# EAGLE design ornamentOrbV1 (EAGLE 9.1.0)
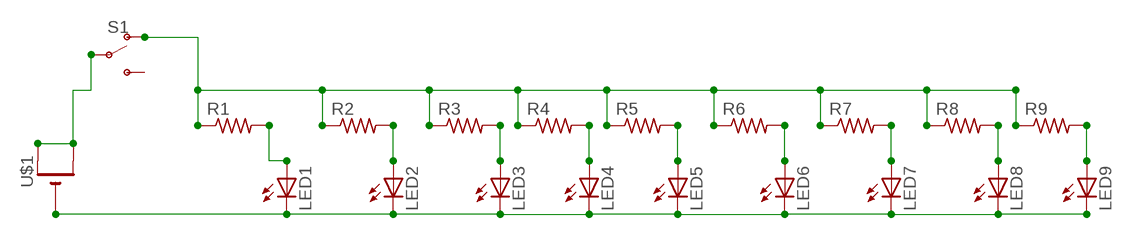
[diagram p0: schematic, sheet 1]

## Parts
LED1  LED5MM  [LED5MM]
LED2  LED5MM  [LED5MM]
LED3  LED5MM  [LED5MM]
LED4  LED5MM  [LED5MM]
LED5  LED5MM  [LED5MM]
LED6  LED5MM  [LED5MM]
LED7  LED5MM  [LED5MM]
LED8  LED5MM  [LED5MM]
LED9  LED5MM  [LED5MM]
R1  R-US_R0805  [R0805]
R2  R-US_R0805  [R0805]
R3  R-US_R0805  [R0805]
R4  R-US_R0805  [R0805]
R5  R-US_R0805  [R0805]
R6  R-US_R0805  [R0805]
R7  R-US_R0805  [R0805]
R8  R-US_R0805  [R0805]
R9  R-US_R0805  [R0805]
S1  SWITCH-SPDT-SMD-RIGHT-ANGLE  [SWITCH_SPST_SMD_A]
U$1  CR2032SMT  [CR2032-SMD]

## Nets
N$1: LED1.A R1.2
N$2: LED2.A R2.2
N$3: LED3.A R3.2
N$4: LED4.A R4.2
N$5: LED5.A R5.2
N$6: LED6.A R6.2
N$7: LED7.A R7.2
N$8: LED8.A R8.2
N$9: LED9.A R9.2
N$10: LED1.K(C) LED2.K(C) LED3.K(C) LED4.K(C) LED5.K(C) LED6.K(C) LED7.K(C) LED8.K(C) LED9.K(C) U$1.-
N$11: R1.1 R2.1 R3.1 R4.1 R5.1 R6.1 R7.1 R8.1 R9.1 S1.1(O)
N$12: S1.2(P) U$1.+$1(+) U$1.+$2(+1)
Unconnected: S1.3(S)

## Library data of the parts
LED1-LED9 = adafruit:LED: LED OSRAM: - CHIPLED LG R971, LG N971, LY N971, LG Q971, LY Q971, LO R971, LY R971 LH N974, LH R974 LS Q976, LO Q976, LY Q976 LO Q996 - Hyper CHIPLED LW Q18S LB Q993, LB Q99A, LB R99A - SideLED LS A670, LO A670, LY A670, LG A670, LP A670 LB A673, LV A673, LT A673, LW A673 LH A674 LY A675 LS A676, LA A676, LO A676, LY A676, LW A676 LS A679, LY A679, LG A679 - Hyper Micro SIDELED® LS Y876, LA Y876, LO Y876, LY Y876 LT Y87S - SmartLED LW L88C, LW L88S LB L89C, LB L89S, LG L890 LS L89K, LO L89K, LY L89K LS L896, LA L896, LO L896, LY L896 - TOPLED LS T670, LO T670, LY T670, LG T670, LP T670 LSG T670, LSP T670, LSY T670, LOP T670, LYG T670 LG T671, LOG T671, LSG T671 LB T673, LV T673, LT T673, LW T673 LH T674 LS T676, LA T676, LO T676, LY T676, LB T676, LH T676, LSB T676, LW T676 LB T67C, LV T67C, LT T67C, LS T67K, LO T67K, LY T67K, LW E67C LS E67B, LA E67B, LO E67B, LY E67B, LB E67C, LV E67C, LT E67C LW T67C LS T679, LY T679, LG T679 LS T770, LO T770, LY T770, LG T770, LP T770 LB T773, LV T773, LT T773, LW T773 LH T774 LS E675, LA E675, LY E675, LS T675 LS T776, LA T776, LO T776, LY T776, LB T776 LHGB T686 LT T68C, LB T68C - Hyper Mini TOPLED® LB M676 - Mini TOPLED Santana® LG M470 LS M47K, LO M47K, LY M47K Source: http://www.osram.convergy.de/
R1-R9 = adafruit:R-US_: RESISTOR, American symbol
S1 = SparkFun-Switches:SWITCH-SPDT: Single Pole, Double Throw (SPDT) Switch Single-pole, double-throw (SPDT) switch. Variant Overview SMD-AYZ0202 Surface Mount DPDT Switch <https://www.sparkfun.com/products/597> (COM-00597) Used on e.g. LilyPad Arduino USB - ATmega32U4 Board <https://www.sparkfun.com/products/12049> PTH-11.6X4.0MM SPDT Mini Power Switch <https://www.sparkfun.com/products/102> (COM-00102) Used on e.g. SparkFun Simon Says - Through-Hole Soldering Kit <https://www.sparkfun.com/products/10547> (KIT-10547) PTH-11.6X4.0MM-KIT KIT version of SPDT Mini Power Switch - Simplifies soldering by removing tStop of switch pins - only one side can be soldered. PTH-11.6X4.0MM-LOCK LOCK version of SPDT Mini Power Switch - Offset pins hold switch in place for easier soldering. SMD-RIGHT-ANGLE Surface Mount Right Angle Switch <https://www.sparkfun.com/products/10860> (COM-10860) Used on e.g. SparkFun ESP8266 Thing <https://www.sparkfun.com/products/13231>; PROD_ID: SWCH-10651; SF_SKU: COM-10860
U$1 = adafruit:CR2032

## Net classes
0 default: clearance 0.205 mm

## Board
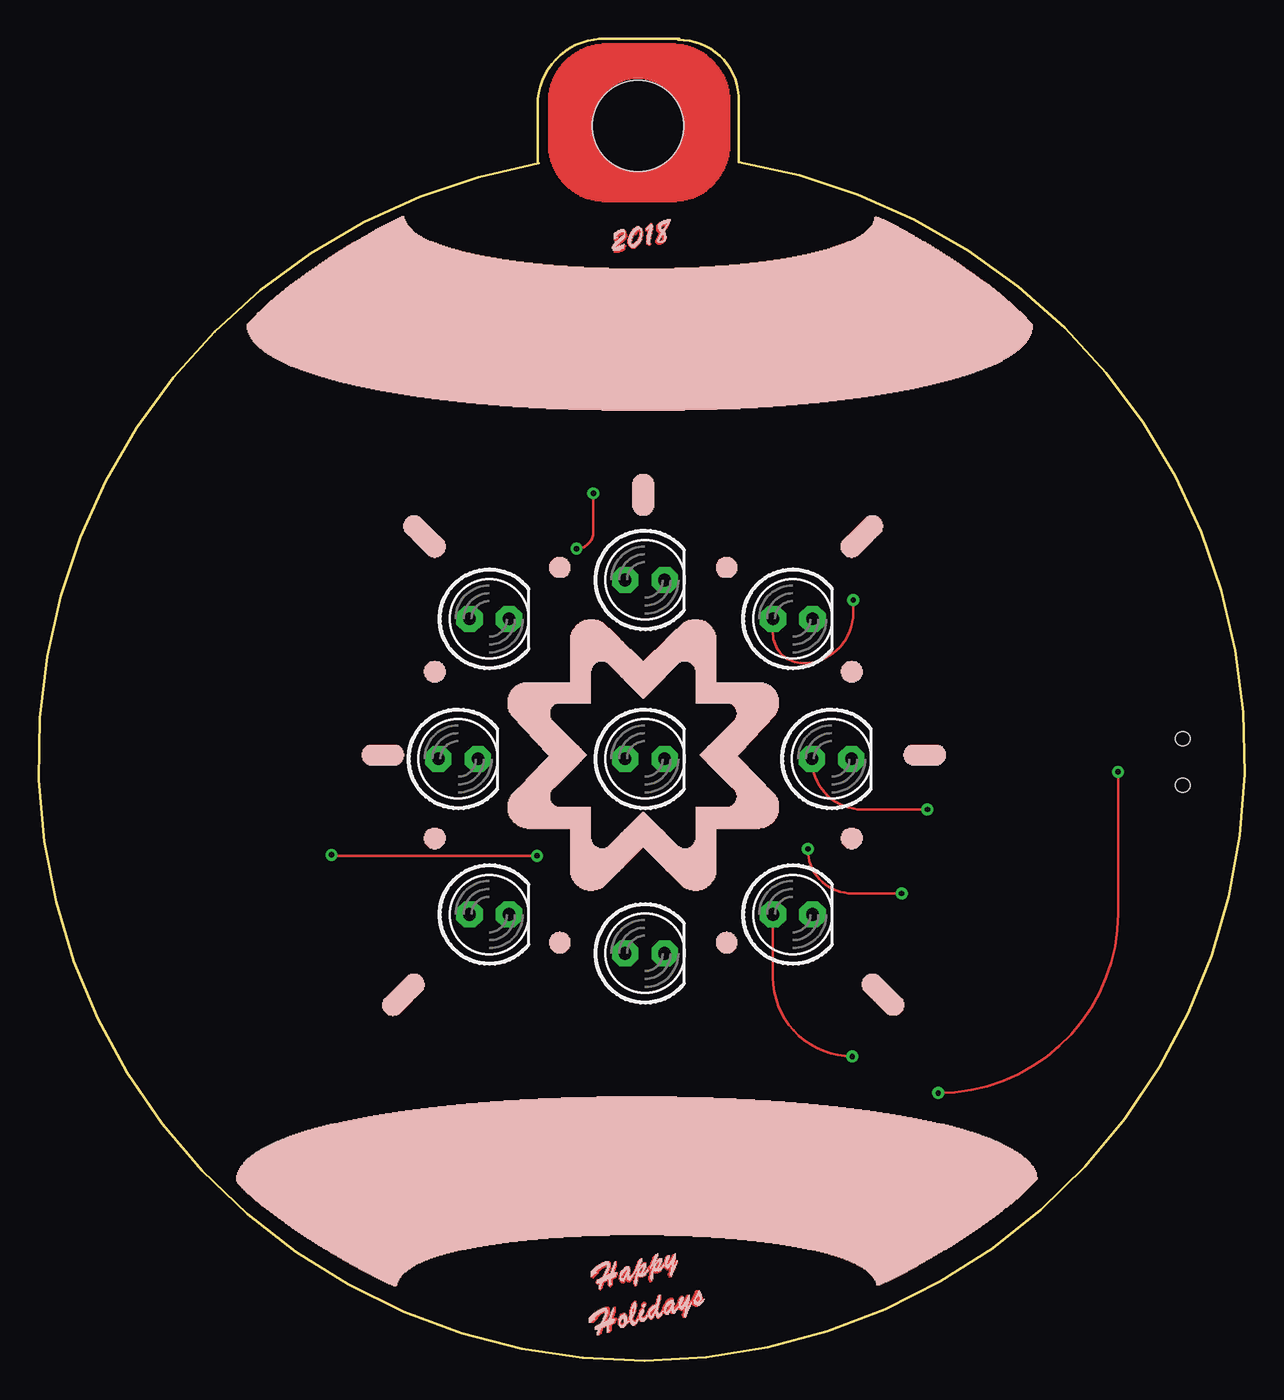
[diagram p1: board, top side]
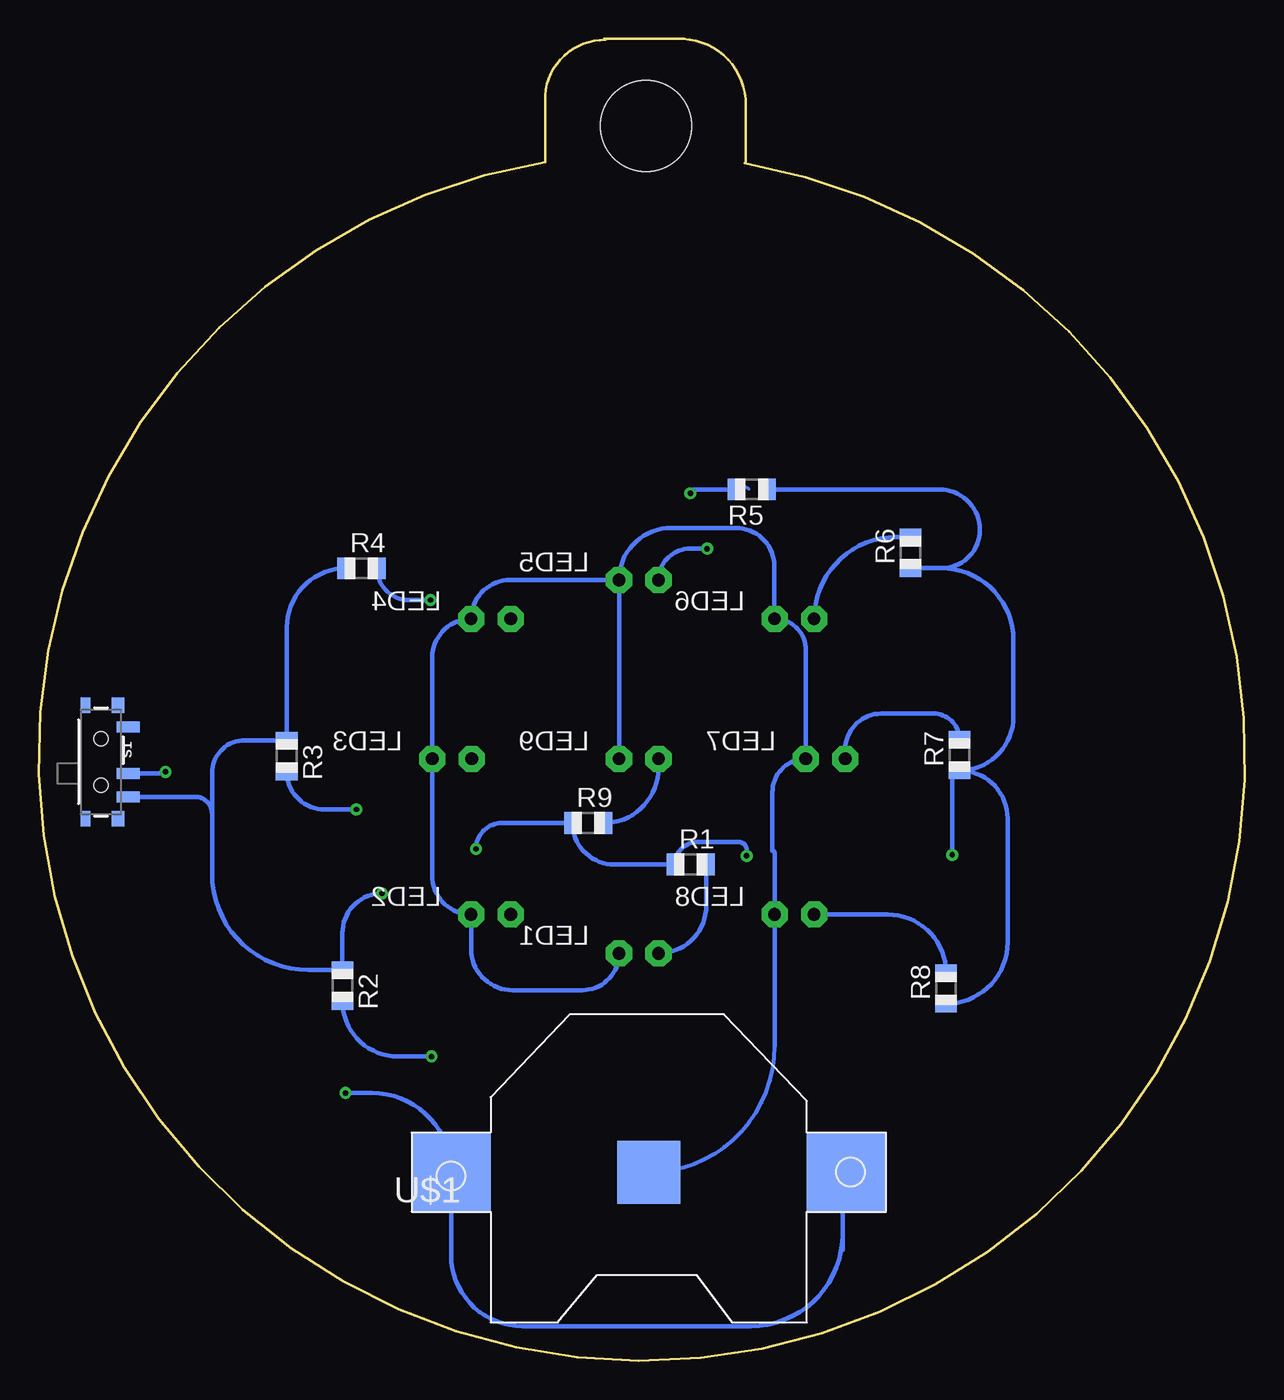
[diagram p2: board, bottom side, seen from below]

Size 77.48 x 84.96 mm. Coordinates in mm from the lower left corner, seen from the top.
Outline: 32.13,76.96 arc341 44.96,77.02 44.96,80.89
Outline: 44.96,80.96 arc93 41.09,84.89
Outline: 32.07,76.96 32.07,81.08 arc-82 36.07,84.96
Outline: 36.01,84.96 41.15,84.96
Copper layers (1*16): Top 0.035mm / dielectric 1.5mm / Bottom 0.035mm
Design rules "default": minimum track width 6mil, minimum drill 0.35mm, track to track 6mil, track to pad 6mil, pad to pad 6mil, via to via 6mil, smd to smd 6mil, copper to edge 40mil, drill to drill 6mil, minimum pad ring 10mil, minimum via ring 8mil, stop-mask expansion 4mil, vias tented up to drill 0mil, thermal gap 10mil
Holes 5.84 mm at 38.48,79.37

### Footprints (pad centres in the part's own frame; a part is rotated, then mirrored left to right if it is on the bottom)
LED5MM = drill 0.813 pad 1.676 octagon: A -1.27,0; K 1.27,0
R0805 = smd 1.1 x 1.4: 1 -1,0; 2 1,0
SWITCH_SPST_SMD_A = smd 0.7 x 1.5: 1 -2.25,-1.75; 2 -0.75,-1.75; 3 2.25,-1.75 | smd 1 x 0.6: GND1 -3.65,1; GND3 3.65,1 | smd 1 x 0.8: GND2 -3.65,-1.1; GND4 3.65,-1.1 | hole 0.9: -1.5,0; 1.5,0
CR2032-SMD = smd 5.08 x 5.08: +$1 -12.7,0; +$2 12.7,0 | smd 4.064 x 4.064: - 0,0

### Placement (x,y rotation side)
LED1  38.94,26.18 0 top
LED2  48.44,28.68 0 top
LED3  50.94,38.68 0 top
LED4  48.44,47.68 0 top
LED5  38.94,50.18 0 top
LED6  28.94,47.68 0 top
LED7  26.94,38.68 0 top
LED8  28.94,28.68 0 top
LED9  38.94,38.68 0 top
R1  35.6,31.89 0 bottom
R2  57.98,24.11 270 bottom
R3  61.55,38.85 270 bottom
R4  56.75,50.93 0 bottom
R5  31.68,56 180 bottom
R6  21.47,51.93 90 bottom
R7  18.33,38.93 90 bottom
R8  19.2,23.93 90 bottom
R9  42.19,34.56 0 bottom
S1  73.5,38.48 90 bottom
U$1  38.29,12.11 180 bottom

### Tracks (layer width: path | path; a pad name or v marks a point on that pad's centre or on a via)
N$1
  Bottom 0.305: LED1.A arc-90 34.6,29.24 R1.2
N$2  (via drill 0.35)
  Top 0.152: v52.26,19.55 arc-90 47.17,24.65 LED2.A
  Bottom 0.305: v52.26,19.55 54.42,19.55 arc90 R2.2
N$3  (via drill 0.35)
  Top 0.152: v57.09,35.43 52.92,35.43 arc-90 LED3.A
  Bottom 0.305: v57.09,35.43 59.12,35.43 arc90 R3.2
N$4  (via drill 0.35)
  Top 0.152: v52.33,48.89 52.33,48.06 arc-90 49.09,44.82 arc-90 47.17,46.74 LED4.A
  Bottom 0.305: v52.33,48.89 53.71,48.89 arc90 R4.2
N$5  (via drill 0.35)
  Top 0.152: v34.55,52.19 arc90 35.63,53.27 v35.63,55.75
  Bottom 0.2: 31.84,56 arc-90 R5.2
  Bottom 0.305: LED5.A arc90 35.65,52.19 v34.55,52.19 | v35.63,55.75 arc90 35.37,56 R5.2
N$6
  Bottom 0.305: LED6.A arc90 22.41,52.93 R6.2
N$7
  Bottom 0.305: LED7.A 25.67,39.29 arc90 23.37,41.59 19.99,41.59 arc90 R7.2
N$8
  Bottom 0.305: LED8.A 22.94,28.68 arc90 R8.2
N$9
  Bottom 0.254: LED9.A 37.67,38.08
  Bottom 0.305: 37.67,38.08 arc90 R9.2
N$10
  Bottom 0.254: U$1.- arc-90 30.21,20.19
  Bottom 0.305: LED9.K LED5.K | LED1.K arc90 42.58,23.81 47.06,23.81 arc90 49.71,26.46 LED2.K arc90 52.21,31.18 LED3.K 52.21,45.18 arc90 LED4.K arc90 47.21,50.18 LED5.K | LED5.K arc90 36.86,53.52 32.7,53.52 arc90 30.23,51.05 30.23,47.7 arc-90 LED6.K arc90 28.21,45.68 LED7.K arc-90 30.35,36.53 30.35,32.76 arc90 30.21,32.61 LED8.K 30.21,20.19
N$11  (via drill 0.35)
  Top 0.152: v18.8,32.51 arc90 18.86,32.44 v32.01,32.44 | v49.4,32.89 arc90 52.26,30.03 v55.44,30.03
  Bottom 0.305: R4.1 arc-90 61.55,47.13 R3.1 arc-90 61.57,39.87 64.26,39.87 arc-90 66.36,37.78 66.36,35.17 | 66.36,35.17 66.36,31.3 arc-90 60.17,25.11 R2.1 57.98,27.49 arc90 v55.44,30.03 | S1.1 67.42,36.23 arc90 66.36,35.17 | R5.1 19.62,56 arc90 17.02,53.4 arc90 19.49,50.93 | 19.49,50.93 R6.1 | R7.1 arc-90 14.86,41.41 14.86,46.31 arc-90 19.49,50.93 | R8.1 arc-90 15.24,26.88 15.24,34.84 arc-90 R7.1 | v32.01,32.44 32.01,32.82 arc-90 32.51,33.33 35.16,33.33 arc-90 R1.1 40.52,31.89 arc90 R9.1 47.73,34.56 arc-90 v49.4,32.89 | v18.8,32.51 18.8,37.47 arc90 R7.1
N$12  (via drill 0.35)
  Top 0.152: v69.34,37.84 69.34,28.82 69.34,28.76 arc-90 v57.79,17.2
  Bottom 0.305: S1.2 69.45,37.73 arc-90 v69.34,37.84 | v57.79,17.2 56.08,17.2 arc90 U$1.+$2 50.99,6.79 arc-90 46.42,2.22 31.75,2.22 arc-90 25.85,8.12 | 25.85,7.11 25.85,8.12 | 25.85,8.12 25.85,11.86 arc90 U$1.+$1
(copper drawn outside any net)
  shapes: Top area x2316